# Altium project BoostConverter.PrjPcb
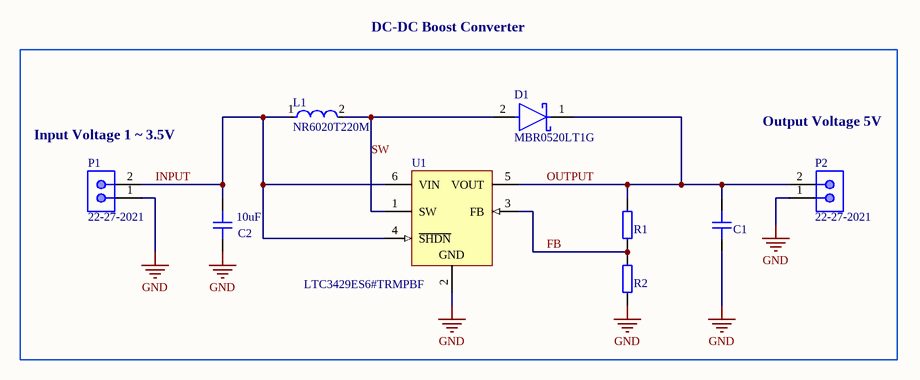
[diagram p0: Schematic.SchDoc]
1 sheet, 9 parts. Net scope: global (net labels, ports and power ports of the same name join across sheets).
Board file: PCBDesign.PcbDoc

## Sheet Schematic.SchDoc
size A; SheetNumber: 1; SheetTotal: 1

### Parts
C1  CAP_0603  [CAP_0603]  (value not drawn)
C2  10uF  [CAP_0603]
D1  MBR0520LT1G  [FP-425-04-IPC_C]
L1  NR6020T220M  [FP-NR6020-MFG]
P1  22-27-2021  [MOLX-22-27-2021_V]
P2  22-27-2021  [MOLX-22-27-2021_V]
R1  RES_0603  [RES_0603]  (value not drawn)
R2  RES_0603  [RES_0603]  (value not drawn)
U1  LTC3429ES6#TRMPBF  [LT-S6-6-TSOT-23_L]

### Nets
GND: C1.1 C2.1 P1.1 P2.1 R2.2 U1.2(GND)
FB: R1.1 R2.1 U1.3(FB)
INPUT: C2.2 L1.1 P1.2 U1.4(~{SHDN}) U1.6(VIN)
OUTPUT: C1.2 D1.1(C) P2.2 R1.2 U1.5(VOUT)
SW: D1.2(A) L1.2 U1.1(SW)

### Notes on the sheet
- DC-DC Boost Converter
- Output Voltage 5V
- (near P1) Input Voltage 1 ~ 3.5V

### Library data of the parts
C1 C2 = CMP-001-00087-1: Capacitor SMD 0603; Manufacturer Part Number: *; Distributor Link: *; Manufacturer: *; Rating: *; Design Item ID: CAP_0603; Source: Schematic-Lib-PhilsLab.SchLib; Dielectric: *; LCSC: *
D1 = CMP-1055-00425-2: DIODE SCHOTTKY 20V 500MA SOD123; Polarity: Standard; Peak Non-Repetitive Surge Current: 5.5A; Forward Voltage: 385mV; Element Configuration: Single; Peak Reverse Current: 250uA; Max Repetitive Reverse Voltage (Vrrm): 20V; Voltage Rating (DC): 20V; Case/Package: SOD-123-2; Number of Pins: 2; Output Current: 500mA; Min Operating Temperature: -65°C; Lead Free: Lead Free; REACH SVHC: No SVHC; Max Reverse Voltage (DC): 20V; Termination: SMD/SMT; Average Rectified Current: 500mA; Max Surge Current: 5.5A; Package Quantity: 3000; Height: 1.12mm; Current Rating: 500mA; Forward Current: 500mA; Max Forward Surge Current (Ifsm): 5.5A; Packaging: Tape and Reel; Length: 2.69mm; Radiation Hardening: No; Max Reverse Leakage Current: 250uA; Width: 1.6mm; Contact Plating: Tin; Max Operating Temperature: 125°C
L1 = CMP-14484-001459-1: SMD Power Inductors 22uH ±20% 0.95A 0.348Ω; DC Resistance (DCR): 348mR; Shielding: Shielded; Core Material: Ferrite; Current Rating: 950mA; Test Frequency: 100kHz; Max DC Current: 1.05A; Self Resonant Frequency: 11MHz; Tolerance: 20%; Termination: SMD/SMT; Max Operating Temperature: 120°C; Length: 0.236inch; Lead Free: Lead Free; Radiation Hardening: No; Case/Package: Nonstandard; Packaging: Tape and Reel; Height - Seated (Max): 0.079inch; Package Quantity: 2500; Inductance: 22uH; Height: 2mm; Mount: Surface Mount; Min Operating Temperature: -25°C; Halogen Free: Halogen Free; RoHS Compliant: Yes; Resistor Type: Wirewound; Series: NR; Saturation Current: 1.05A; Depth: 6.2mm; Width: 6mm
P1 P2 = CMP-2000-05537-1: Male Header, Pitch 2.54 mm, 1 x 2 Position, Height 11.7 mm, Tail Length 3.56 mm, 0 to 75 degC, RoHS, Bulk; Manufacturer: Molex; PartNumber: 0022272021; Current rating: 4A; Package Version: Rev. BC, 02/2012; Voltage rating: 250V; No. of Positions: 2; Pitch: 2.54mm; No. of Rows: 1; Orientation: Vertical; Operating temperature: 0°Cto+75°C; Manufacturer URL: http://www.molex.com/; Mounting Technology: ThroughHole; Housing material: Nylon(UL94V-0); Package Description: 2-Leads Header, Body 5.08 x 5.8 mm, Pitch 2.54 mm; Voltage - Max: 250V; Datasheet URL: http://www.molex.com/pdm_docs/sd/022272021_sd.pdf; Package Reference: 22-27-2021; Contact material: Tinplatedbrass; Current - Max: 4A; Datasheet Version: Rev. F, 06/2009
R1 R2 = CMP-009-00183-1: Resistor SMD 0603; Manufacturer Part Number: *; Distributor Link: *; LCSC: *; Source: Schematic-Lib-PhilsLab.SchLib; Manufacturer: *; Design Item ID: RES_0603
U1 = CMP-0492-01773-1: 600 mA, 500 kHz Micropower Synchronous Boost Converter with Output Disconnect, 6-pin SOT23 (S6-6), -40 to 85 degC, Pb-Free, Mini Tape and Reel; Manufacturer: Linear Technology; Number of Outputs: 1; PackageReference: S6-6; ComponentLink2URL: http://cds.linear.com/docs/en/datasheet/3429fa.pdf; ComponentLink1Description: Manufacturer URL; Code_JEDEC: MO-193; Mounting Technology: Surface Mount; PackageDescription: 6-Pin Plastic TSOT-23, Body 2.9 x 1.63 mm, Pitch 0.95 mm; ComponentLink1URL: http://www.linear.com/; ComponentLink3Description: Package Specification; PartNumber: LTC3429ES6#TRMPBF; ComponentLink3URL: http://cds.linear.com/docs/en/packaging/SOT_6_05-08-1636.pdf; ComponentLink2Description: Datasheet; DatasheetVersion: Rev. A; RoHS: TRUE; PackageVersion: Jun-10; Packing: Mini Tape and Reel